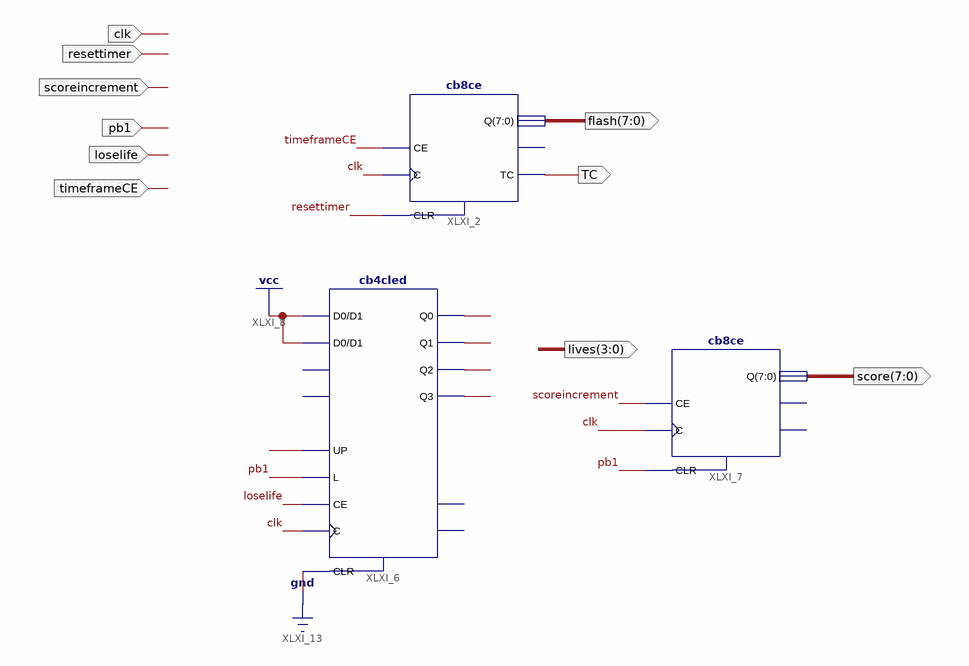
[diagram p0: schematic sheet 1]
// Xilinx ISE schematic ScorenTimer.sch (spartan3e) as structural Verilog: 3 symbols, 10 ports
module ScorenTimer (
  input  clk,
  input  resettimer,
  input  scoreincrement,
  input  pb1,
  input  loselife,
  input  timeframeCE,
  output TC,
  output [7:0] flash,
  output [7:0] score,
  output [3:0] lives
);

  wire XLXN_58;

  cb8ce XLXI_2 (.C(clk), .CE(timeframeCE), .CLR(resettimer), .Q(flash), .TC(TC));  // open: CEO
  cb8ce XLXI_7 (.C(clk), .CE(scoreincrement), .CLR(pb1), .Q(score));  // open: CEO, TC
  cb4cled XLXI_6 (
    .C(clk), .CE(loselife), .CLR(1'b0), .D0(1'b1), .D1(1'b1), .L(pb1), .UP(XLXN_58), .Q0(lives[0]),
    .Q1(lives[1]), .Q2(lives[2]), .Q3(lives[3]));  // open: D2, D3, CEO, TC
endmodule
